# EAGLE design balancing_robot_psoc (EAGLE 7.4.0)
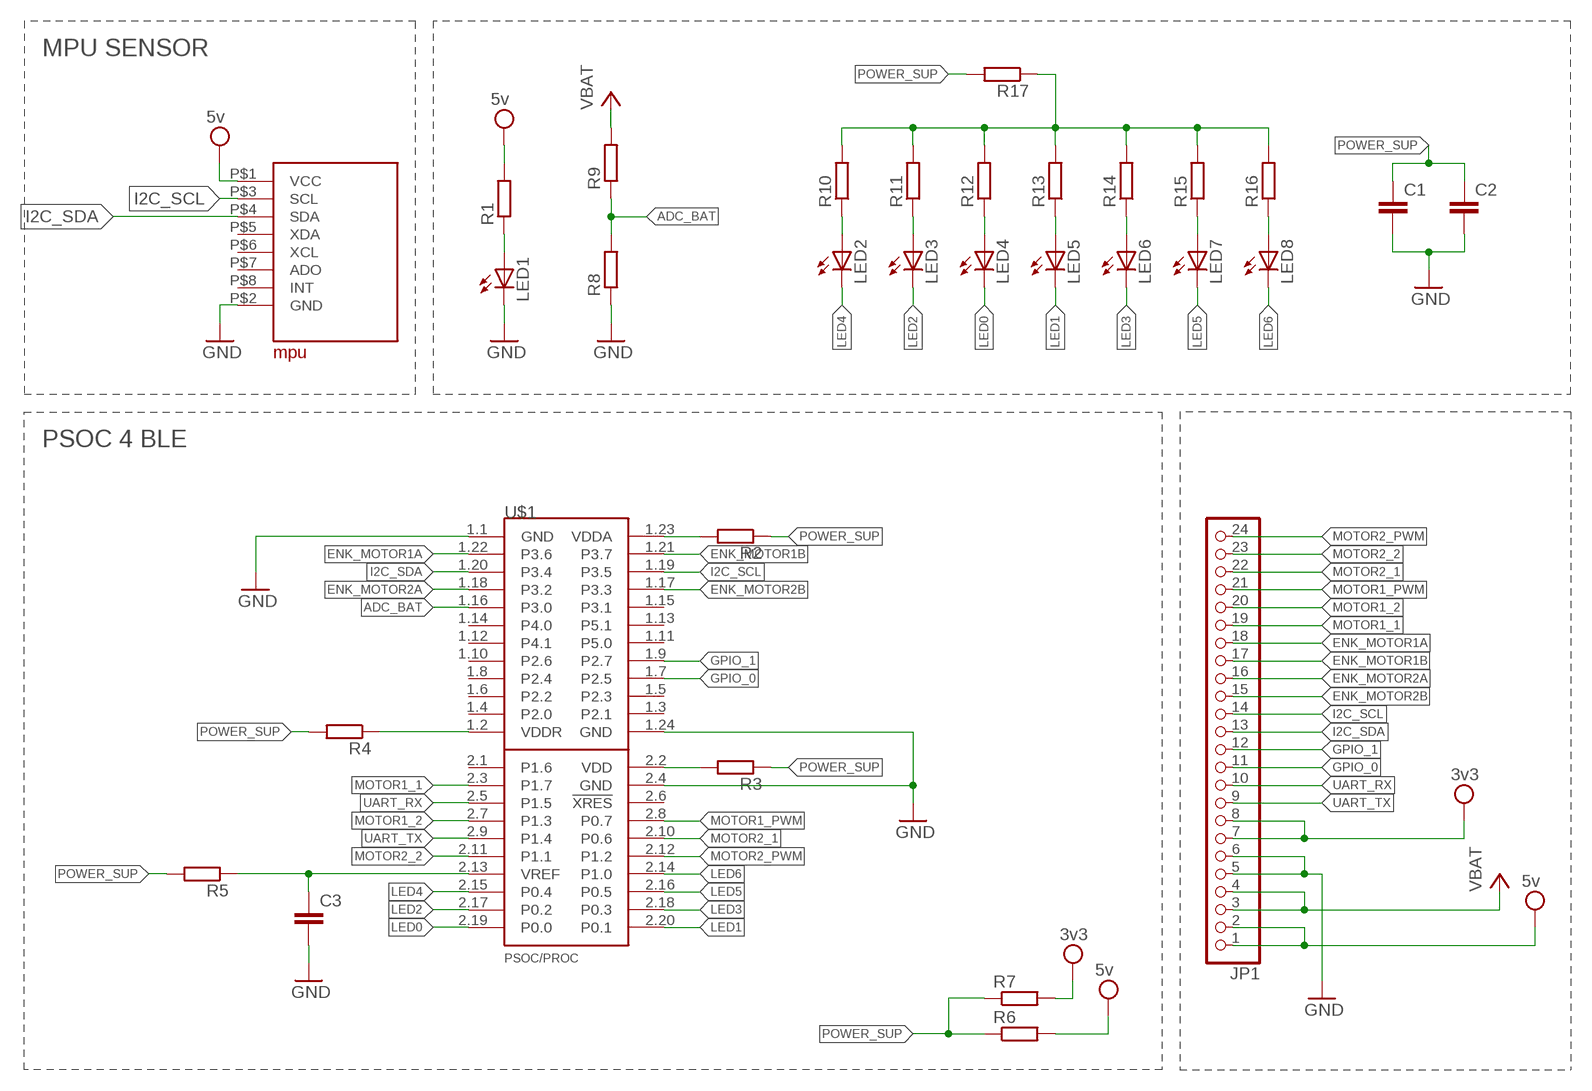
[diagram p0: schematic, sheet 1]

## Parts
C1  C-EUC0603  [C0603]
C2  C-EUC0805  [C0805]
C3  C-EUC0603  [C0603]
JP1  PINHD-1X24  [1X24]
LED1  LEDCHIP-LED0603  [CHIP-LED0603]
LED2  LEDCHIP-LED0603  [CHIP-LED0603]
LED3  LEDCHIP-LED0603  [CHIP-LED0603]
LED4  LEDCHIP-LED0603  [CHIP-LED0603]
LED5  LEDCHIP-LED0603  [CHIP-LED0603]
LED6  LEDCHIP-LED0603  [CHIP-LED0603]
LED7  LEDCHIP-LED0603  [CHIP-LED0603]
LED8  LEDCHIP-LED0603  [CHIP-LED0603]
R1  R-EU_R0603  [R0603]
R2  R-EU_R0603  [R0603]
R3  R-EU_R0603  [R0603]
R4  R-EU_R0603  [R0603]
R5  R-EU_R0603  [R0603]
R6  R-EU_R0603  [R0603]
R7  R-EU_R0603  [R0603]
R8  R-EU_R0603  [R0603]
R9  R-EU_R0603  [R0603]
R10  R-EU_R0603  [R0603]
R11  R-EU_R0603  [R0603]
R12  R-EU_R0603  [R0603]
R13  R-EU_R0603  [R0603]
R14  R-EU_R0603  [R0603]
R15  R-EU_R0603  [R0603]
R16  R-EU_R0603  [R0603]
R17  R-EU_R0603  [R0603]
U$1  PSOC/PROC  [PSOC/PROC_SOCKET]
U$5  MPU  [MPU]

## Nets
3V3: JP1.7 JP1.8 R7.2 ; supply symbol labelled 3v3
5V: JP1.1 JP1.2 R1.2 R6.2 U$5.P$1(VCC) ; supply symbol labelled 5v
ADC_BAT: R8.2 R9.1 U$1.1.16(P3.0)
CONN1: R10.2 R11.2 R12.2 R13.2 R14.2 R15.2 R16.2 R17.1
ENK_MOTOR1A: JP1.18 U$1.1.22(P3.6)
ENK_MOTOR1B: JP1.17 U$1.1.21(P3.7)
ENK_MOTOR2A: JP1.16 U$1.1.18(P3.2)
ENK_MOTOR2B: JP1.15 U$1.1.17(P3.3)
GND: C1.2 C2.2 C3.2 JP1.5 JP1.6 LED1.C R8.1 U$1.1.1(GND) U$1.1.24(GND) U$1.2.4(GND) U$5.P$2(GND)
GPIO_0: JP1.11 U$1.1.7(P2.5)
GPIO_1: JP1.12 U$1.1.9(P2.7)
I2C_SCL: JP1.14 U$1.1.19(P3.5) U$5.P$3(SCL)
I2C_SDA: JP1.13 U$1.1.20(P3.4) U$5.P$4(SDA)
LED0: LED4.C U$1.2.19(P0.0)
LED1: LED5.C U$1.2.20(P0.1)
LED2: LED3.C U$1.2.17(P0.2)
LED3: LED6.C U$1.2.18(P0.3)
LED4: LED2.C U$1.2.15(P0.4)
LED5: LED7.C U$1.2.16(P0.5)
LED6: LED8.C U$1.2.14(P1.0)
MOTOR1_1: JP1.19 U$1.2.3(P1.7)
MOTOR1_2: JP1.20 U$1.2.7(P1.3)
MOTOR1_PWM: JP1.21 U$1.2.8(P0.7)
MOTOR2_1: JP1.22 U$1.2.10(P0.6)
MOTOR2_2: JP1.23 U$1.2.11(P1.1)
MOTOR2_PWM: JP1.24 U$1.2.12(P1.2)
N$1: R2.2 U$1.1.23(VDDA)
N$2: C3.1 R5.1 U$1.2.13(VREF)
N$3: R3.2 U$1.2.2(VDD)
N$4: R4.1 U$1.1.2(VDDR)
N$5: LED2.A R10.1
N$6: LED3.A R11.1
N$11: LED4.A R12.1
N$12: LED5.A R13.1
N$13: LED6.A R14.1
N$14: LED7.A R15.1
N$15: LED8.A R16.1
N$38: LED1.A R1.1
POWER_SUP: C1.1 C2.1 R2.1 R3.1 R4.2 R5.2 R6.1 R7.1 R17.2
UART_RX: JP1.10 U$1.2.5(P1.5)
UART_TX: JP1.9 U$1.2.9(P1.4)
VCC: JP1.3 JP1.4 R9.2 ; supply symbol labelled VBAT
Unconnected: U$1.1.3(P2.1) U$1.1.4(P2.0) U$1.1.5(P2.3) U$1.1.6(P2.2) U$1.1.8(P2.4) U$1.1.10(P2.6) U$1.1.11(P5.0) U$1.1.12(P4.1) U$1.1.13(P5.1) U$1.1.14(P4.0) U$1.1.15(P3.1) U$1.2.1(P1.6) U$1.2.6(!XRES) U$5.P$5(XDA) U$5.P$6(XCL) U$5.P$7(ADO) U$5.P$8(INT)

## Notes on the sheet
- MPU SENSOR
- PSOC 4 BLE

## Library data of the parts
C1-C3 = rcl:C-EU: CAPACITOR, European symbol
JP1 = pinhead:PINHD-1X24: PIN HEADER
LED1-LED8 = led:LED: LED OSRAM: - CHIPLED LG R971, LG N971, LY N971, LG Q971, LY Q971, LO R971, LY R971 LH N974, LH R974 LS Q976, LO Q976, LY Q976 LO Q996 - Hyper CHIPLED LW Q18S LB Q993, LB Q99A, LB R99A - SideLED LS A670, LO A670, LY A670, LG A670, LP A670 LB A673, LV A673, LT A673, LW A673 LH A674 LY A675 LS A676, LA A676, LO A676, LY A676, LW A676 LS A679, LY A679, LG A679 - Hyper Micro SIDELED® LS Y876, LA Y876, LO Y876, LY Y876 LT Y87S - SmartLED LW L88C, LW L88S LB L89C, LB L89S, LG L890 LS L89K, LO L89K, LY L89K LS L896, LA L896, LO L896, LY L896 - TOPLED LS T670, LO T670, LY T670, LG T670, LP T670 LSG T670, LSP T670, LSY T670, LOP T670, LYG T670 LG T671, LOG T671, LSG T671 LB T673, LV T673, LT T673, LW T673 LH T674 LS T676, LA T676, LO T676, LY T676, LB T676, LH T676, LSB T676, LW T676 LB T67C, LV T67C, LT T67C, LS T67K, LO T67K, LY T67K, LW E67C LS E67B, LA E67B, LO E67B, LY E67B, LB E67C, LV E67C, LT E67C LW T67C LS T679, LY T679, LG T679 LS T770, LO T770, LY T770, LG T770, LP T770 LB T773, LV T773, LT T773, LW T773 LH T774 LS E675, LA E675, LY E675, LS T675 LS T776, LA T776, LO T776, LY T776, LB T776 LHGB T686 LT T68C, LB T68C - Hyper Mini TOPLED® LB M676 - Mini TOPLED Santana® LG M470 LS M47K, LO M47K, LY M47K Source: http://www.osram.convergy.de LUXEON: - LUMILED® LXK2-PW12-R00, LXK2-PW12-S00, LXK2-PW14-U00, LXK2-PW14-V00 LXK2-PM12-R00, LXK2-PM12-S00, LXK2-PM14-U00 LXK2-PE12-Q00, LXK2-PE12-R00, LXK2-PE12-S00, LXK2-PE14-T00, LXK2-PE14-U00 LXK2-PB12-K00, LXK2-PB12-L00, LXK2-PB12-M00, LXK2-PB14-N00, LXK2-PB14-P00, LXK2-PB14-Q00 LXK2-PR12-L00, LXK2-PR12-M00, LXK2-PR14-Q00, LXK2-PR14-R00 LXK2-PD12-Q00, LXK2-PD12-R00, LXK2-PD12-S00 LXK2-PH12-R00, LXK2-PH12-S00 LXK2-PL12-P00, LXK2-PL12-Q00, LXK2-PL12-R00 Source: www.luxeon.com KINGBRIGHT: KA-3528ASYC Source: www.kingbright.com
R1-R17 = rcl:R-EU_: RESISTOR, European symbol
U$1 = SmartCart:PSOC/PROC
U$5 = MPU:MPU

## Board
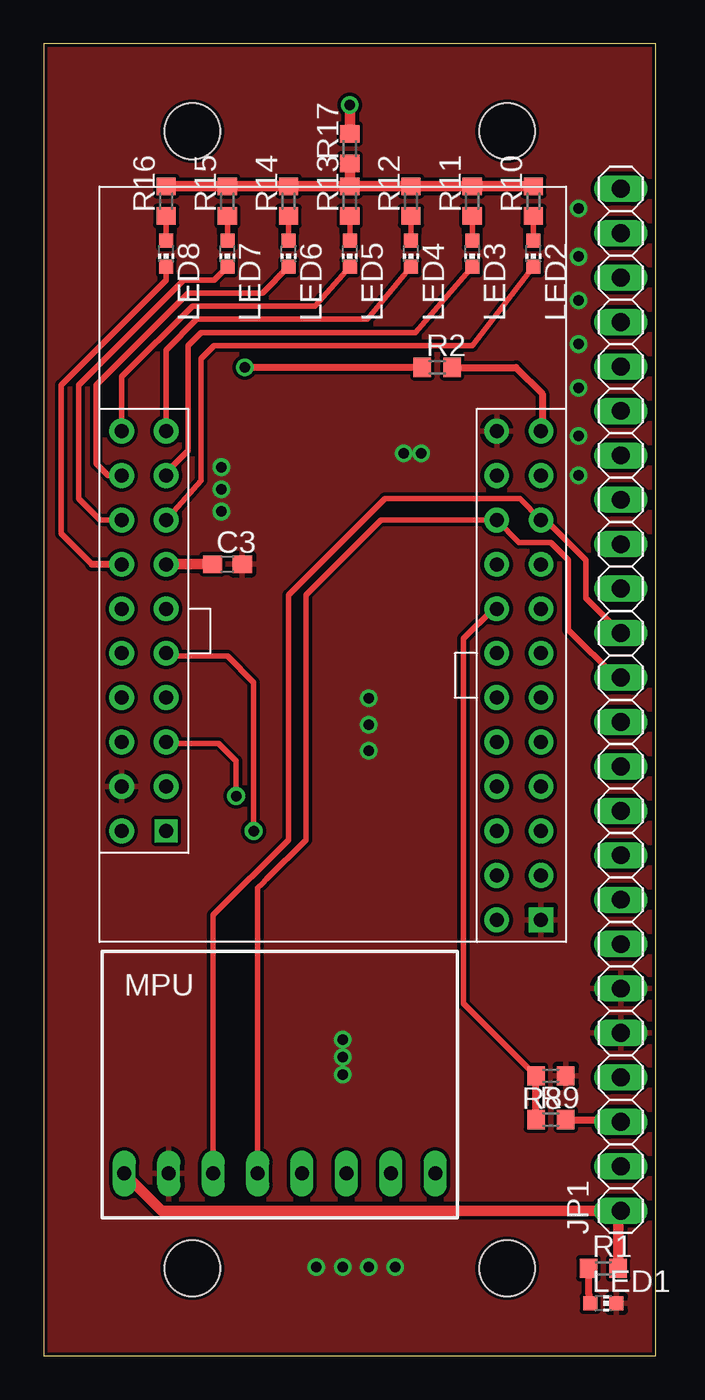
[diagram p1: board, top side]
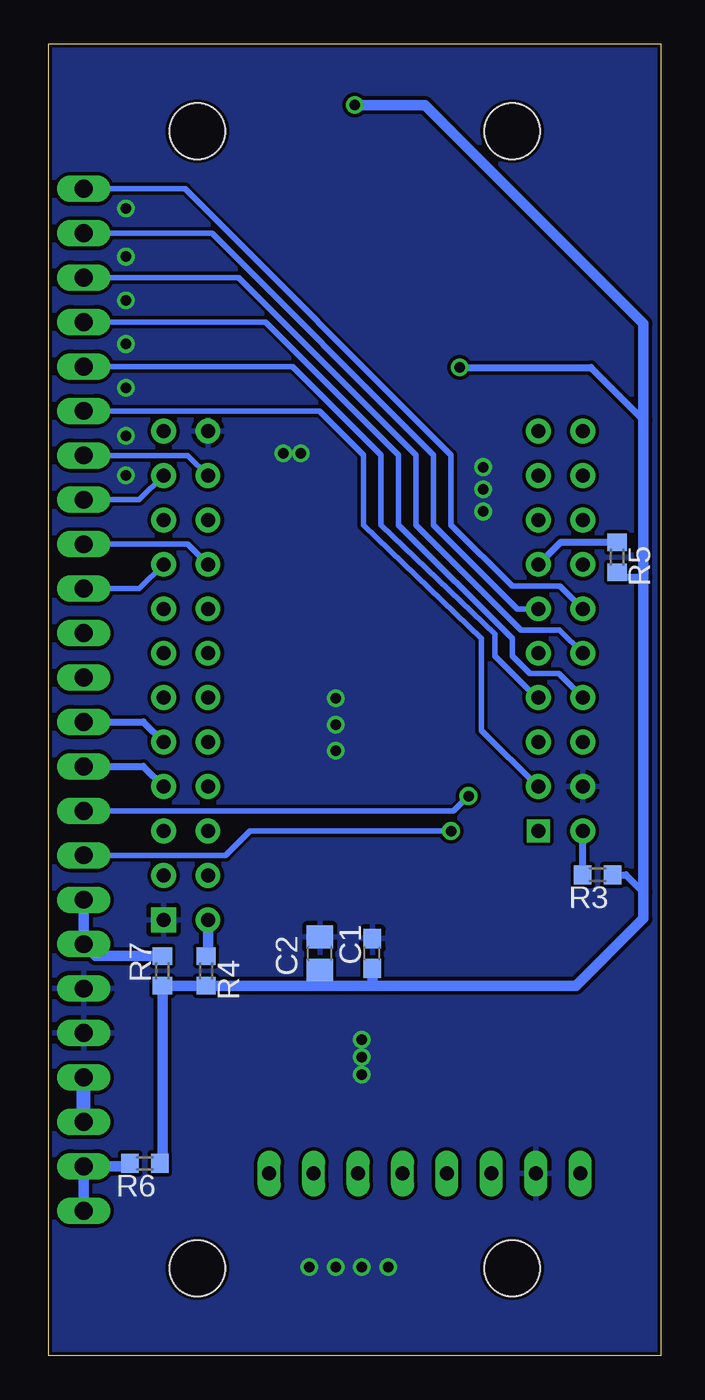
[diagram p2: board, bottom side, seen from below]

Size 35 x 75 mm. Coordinates in mm from the lower left corner, seen from the top.
Outline: 0,0 35,0 35,75 0,75 0,0
Copper layers (1*16): Top 0.035mm / dielectric 1.5mm / Bottom 0.035mm
Design rules "default *": minimum track width 10mil, minimum drill 0.05mm, track to track 8mil, track to pad 8mil, pad to pad 8mil, via to via 8mil, smd to smd 8mil, copper to edge 8mil, drill to drill 8mil, minimum pad ring 10mil, minimum via ring 8mil, stop-mask expansion 4mil, vias tented up to drill 0mil, thermal gap 10mil
Holes 3.2 mm at 8.5,5 26.5,5 8.5,70 26.5,70

### Footprints (pad centres in the part's own frame; a part is rotated, then mirrored left to right if it is on the bottom)
C0603 = smd 1.1 x 1: 1 -0.85,0; 2 0.85,0
C0805 = smd 1.3 x 1.5: 1 -0.95,0; 2 0.95,0
1X24 = drill 1.016 long: 1 -29.21,0; 2 -26.67,0; 3 -24.13,0; 4 -21.59,0; 5 -19.05,0; 6 -16.51,0; 7 -13.97,0; 8 -11.43,0; 9 -8.89,0; 10 -6.35,0; 11 -3.81,0; 12 -1.27,0; 13 1.27,0; 14 3.81,0; 15 6.35,0; 16 8.89,0; 17 11.43,0; 18 13.97,0; 19 16.51,0; 20 19.05,0; 21 21.59,0; 22 24.13,0; 23 26.67,0; 24 29.21,0
CHIP-LED0603 = smd 0.8 x 0.8: A 0,-0.75; C 0,0.75
R0603 = smd 1 x 1.1: 1 -0.85,0; 2 0.85,0
PSOC/PROC_SOCKET = drill 0.8 pad 1.422 square: 1.1 21.44,-5.08 | drill 0.8 pad 1.422: 1.2 18.9,-5.08; 1.3 21.44,-2.54; 1.4 18.9,-2.54; 1.5 21.44,0; 1.6 18.9,0; 1.7 21.44,2.54; 1.8 18.9,2.54; 1.9 21.44,5.08; 1.10 18.9,5.08; 1.11 21.44,7.62; 1.12 18.9,7.62; 1.13 21.44,10.16; 1.14 18.9,10.16; 1.15 21.44,12.7; 1.16 18.9,12.7; 1.17 21.44,15.24; 1.18 18.9,15.24; 1.19 21.44,17.78; 1.20 18.9,17.78; 1.21 21.44,20.32; 1.22 18.9,20.32; 1.23 21.44,22.86; 1.24 18.9,22.86; 2.2 -2.54,0; 2.3 0,2.54; 2.4 -2.54,2.54; 2.5 0,5.08; 2.6 -2.54,5.08; 2.7 0,7.62; 2.8 -2.54,7.62; 2.9 0,10.16; 2.10 -2.54,10.16; 2.11 0,12.7; 2.12 -2.54,12.7; 2.13 0,15.24; 2.14 -2.54,15.24; 2.15 0,17.78; 2.16 -2.54,17.78; 2.17 0,20.32; 2.18 -2.54,20.32; 2.19 0,22.86; 2.20 -2.54,22.86 | drill 0.8 square: 2.1 0,0
MPU = drill 0.8 long: P$1 -8.89,-5.08; P$2 -6.35,-5.08; P$3 -3.81,-5.08; P$4 -1.27,-5.08; P$5 1.27,-5.08; P$6 3.81,-5.08; P$7 6.35,-5.08; P$8 8.89,-5.08

### Placement (x,y rotation side)
C1  16.5,23 90 bottom
C2  19.5,23 90 bottom
C3  10.5,45.25 0 top
JP1  33,37.5 90 top
LED1  32,3 270 top
LED2  28,63 180 top
LED3  24.5,63 180 top
LED4  21,63 180 top
LED5  17.5,63 180 top
LED6  14,63 180 top
LED7  10.5,63 180 top
LED8  7,63 180 top
R1  32,5 0 top
R2  22.5,56.5 0 top
R3  3.62,27.49 180 bottom
R4  26,22 270 bottom
R5  2.5,45.65 270 bottom
R6  29.5,11 180 bottom
R7  28.5,22 90 bottom
R8  29,16 180 top
R9  29,13.5 0 top
R10  28,66 90 top
R11  24.5,66 90 top
R12  21,66 90 top
R13  17.5,66 90 top
R14  14,66 90 top
R15  10.5,66 90 top
R16  7,66 90 top
R17  17.5,69 90 top
U$1  7,30 0 top
U$5  13.5,15.5 0 top

### Tracks (layer width: path | path; a pad name or v marks a point on that pad's centre or on a via)
3V3
  Bottom 0.61: JP1.8 JP1.7 32.32,22.85 R7.2
5V
  Top 0.61: JP1.1 32.85,8.29 | 32.85,8.29 R1.2 | 32.85,8.29 6.74,8.29 U$5.P$1
  Bottom 0.61: JP1.1 JP1.2 30.35,10.83 R6.2
ADC_BAT
  Top 0.305: U$1.1.16 25.7,42.7 24,41 24,20.15 R8.2
  Top 0.406: R9.1 R8.2 28,16
CONN1
  Top 0.61: R16.2 R15.2 R14.2 R13.2 | R13.2 R12.2 R11.2 R10.2 | R13.2 R17.1
ENK_MOTOR1A
  Bottom 0.305: JP1.18 27.05,51.47 U$1.1.22
ENK_MOTOR1B
  Bottom 0.305: JP1.17 29.83,48.93 U$1.1.21
ENK_MOTOR2A
  Bottom 0.305: JP1.16 27.05,46.39 U$1.1.18
ENK_MOTOR2B
  Bottom 0.305: JP1.15 29.83,43.85 U$1.1.17
GND  (via drill 0.6)
  other vias: 10.16,48.26 10.16,49.53 10.16,50.8 17.09,18.08 20.09,5.08 18.59,5.08 17.09,5.08 15.59,5.08 17.09,17.08 17.09,16.08 18.59,34.58 18.59,36.08 18.59,37.58 20.59,51.58 21.59,51.58 30.59,50.33 30.59,52.58 30.59,55.33 30.59,57.83 30.59,60.33 30.59,62.83 30.59,65.58
  pour Bottom: -1.27,76.2 36.83,76.2 36.83,-1.27 -1.27,-1.27
  pour Top: -2.54,77.47 38.1,77.47 38.1,-2.54 -2.54,-2.54
GPIO_0
  Bottom 0.406: JP1.11 29.59,33.69 U$1.1.7
GPIO_1
  Bottom 0.406: JP1.12 29.59,36.23 U$1.1.9
I2C_SCL
  Top 0.305: JP1.14 31,43.31 31,45.5 28.72,47.78 U$1.1.19 27.22,49 19.5,49 14,43.5 14,29.5 9.69,25.19 U$5.P$3
I2C_SDA
  Top 0.305: 32.73,38.77 30,41.5 30,45.5 29,46.5 27.18,46.5 U$1.1.20 19.28,47.78 15,43.5 15,29.5 12.75,27.25 12.5,27 12.23,26.73 U$5.P$4
  Top 0.406: JP1.13 32.73,38.77
LED0
  Top 0.305: LED4.C 18.5,59.25 8.75,59.25 7,57.5 U$1.2.19
LED1
  Top 0.305: LED5.C 15.5,60 8.5,60 4.46,55.96 U$1.2.20
LED2
  Top 0.305: LED3.C 21.25,58.5 9,58.5 8.25,57.75 8.25,51.75 7,50.5
  Top 0.406: U$1.2.17 7,50.5
LED3
  Top 0.305: U$1.2.18 3.68,50.32 3,51 3,55.5 8.25,60.75 12.5,60.75 LED6.C
LED4
  Top 0.305: LED2.C 24.5,57.75 9.75,57.75 9,57 9,50.03 U$1.2.15
LED5
  Top 0.305: U$1.2.16 3.22,47.78 2,49 2,55.5 8,61.5 9.75,61.5 LED7.C
LED6
  Top 0.305: 2.76,45.24 1,47 1,55.5 7,61.5 LED8.C
  Top 0.406: U$1.2.14 2.76,45.24
MOTOR1_1
  Bottom 0.305: JP1.19 19.51,54.01 17,51.5 17,47.5 10.25,41 10.25,35.75 7.04,32.54 U$1.2.3
MOTOR1_2
  Bottom 0.305: JP1.20 21.05,56.55 16,51.5 16,47.5 9.5,41.25 9.5,40 7.12,37.62 U$1.2.7
MOTOR1_PWM
  Bottom 0.305: JP1.21 22.59,59.09 15,51.5 15,47.5 8.5,41 8.5,40 7.5,39 5.84,39 U$1.2.8
MOTOR2_1
  Bottom 0.305: JP1.22 24.13,61.63 14,51.5 14,47.5 8,41.5 5.8,41.5 U$1.2.10
MOTOR2_2
  Bottom 0.305: JP1.23 25.67,64.17 13,51.5 13,47.5 8.2,42.7 U$1.2.11
MOTOR2_PWM
  Bottom 0.305: JP1.24 27.21,66.71 12,51.5 12,47.5 8.5,44 5.76,44 U$1.2.12
N$1
  Top 0.406: R2.2 27,56.5 28.5,55 28.5,52.92 U$1.1.23
N$2
  Top 0.61: U$1.2.13 C3.1
  Bottom 0.406: R5.1 5.74,46.5 U$1.2.13
N$3
  Bottom 0.406: R3.2 U$1.2.2
N$4
  Bottom 0.61: R4.1 25.9,22.85 U$1.1.2
N$5
  Top 0.305: R10.1 LED2.A
N$6
  Top 0.305: R11.1 LED3.A
N$11
  Top 0.305: R12.1 LED4.A
N$12
  Top 0.305: R13.1 LED5.A
N$13
  Top 0.305: R14.1 LED6.A
N$14
  Top 0.305: R15.1 LED7.A
N$15
  Top 0.305: R16.1 LED8.A
N$38
  Top 0.406: R1.1 31.15,3.6 LED1.A
POWER_SUP  (via drill 0.6)
  Top 0.406: R2.1 v11.5,56.5
  Top 0.61: v17.5,71.5 R17.2
  Bottom 0.406: 1,44.5 2.2,44.5 R5.2 | R3.1 1.99,27.49 1,26.5 | v11.5,56.5 4,56.5 1,53.5
  Bottom 0.61: R6.1 28.5,11.15 R7.1 R4.2 19.5,21.15 | 16.5,21.15 4.85,21.15 1,25 1,26.5 1,44.5 1,53.5 1,59 13.5,71.5 v17.5,71.5 | 16.5,21.15 19.5,21.15 | C1.1 16.5,21.15 | C2.1 19.5,21.15
UART_RX  (via drill 0.6)
  Top 0.305: v11,32 11,34 10,35 7.08,35 U$1.2.5
  Bottom 0.305: JP1.10 11.85,31.15 v11,32
UART_TX  (via drill 0.6)
  Top 0.305: v12,30 12,38.5 10.5,40 7.16,40 U$1.2.9
  Bottom 0.305: JP1.9 24.89,28.61 23.5,30 v12,30
VCC
  Top 0.406: R9.2 32.87,13.5 JP1.3
  Bottom 0.813: JP1.3 JP1.4